# EAGLE schematic ARCS_MEGA_schematic (EAGLE 9.7.0)
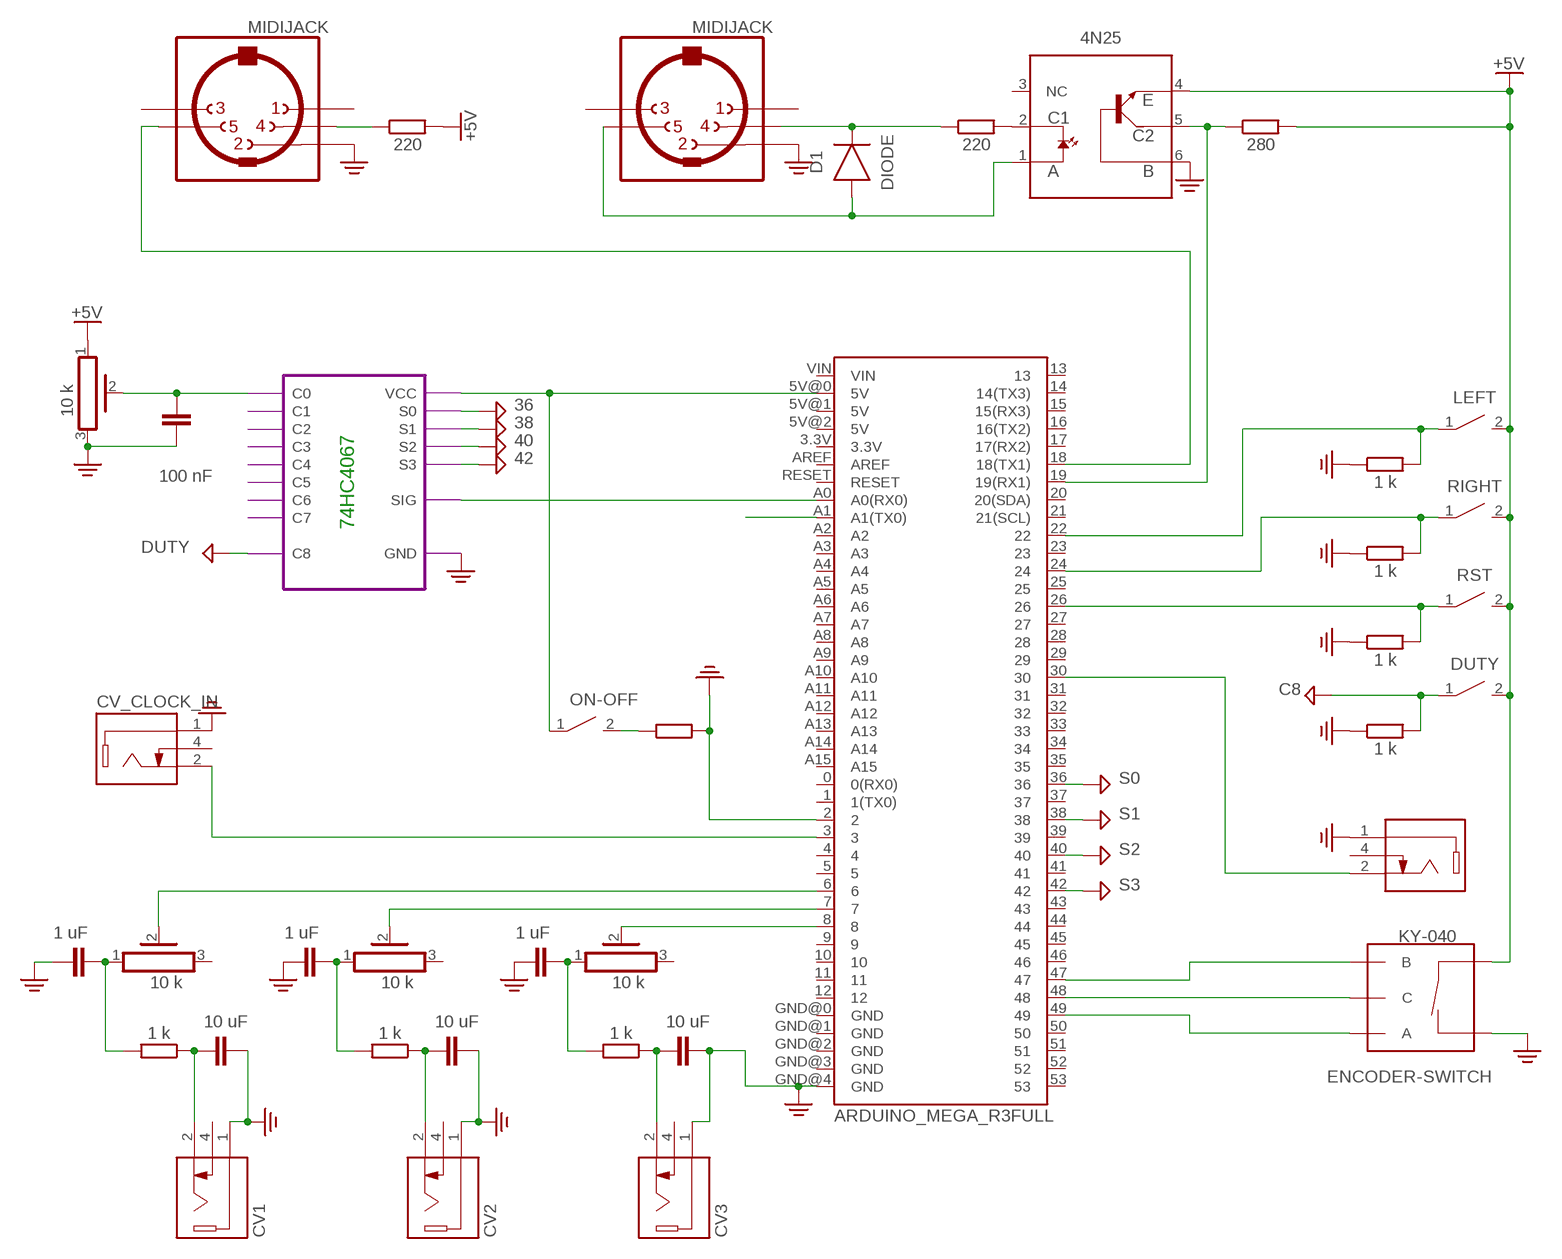
[diagram p0: schematic, sheet 1]

## Parts
B1  ARDUINO_MEGA_R3FULL  [ARDUINO_MEGA]
C1  100 nF  C_RADIAL-55.5MM-DIA  [CAPRD2261W240D5080H5555B]
C2  1 uF  C_RADIAL-55.5MM-DIA  [CAPRD2261W240D5080H5555B]
C3  10 uF  C_RADIAL-55.5MM-DIA  [CAPRD2261W240D5080H5555B]
C4  1 uF  C_RADIAL-55.5MM-DIA  [CAPRD2261W240D5080H5555B]
C5  10 uF  C_RADIAL-55.5MM-DIA  [CAPRD2261W240D5080H5555B]
C6  1 uF  C_RADIAL-55.5MM-DIA  [CAPRD2261W240D5080H5555B]
C7  10 uF  C_RADIAL-55.5MM-DIA  [CAPRD2261W240D5080H5555B]
CV1  MJ-2523-SMT-TR  [MJ-2523-SMT-TR]
CV2  MJ-2523-SMT-TR  [MJ-2523-SMT-TR]
CV3  MJ-2523-SMT-TR  [MJ-2523-SMT-TR]
CV_CLOCK_IN  MJ-2523-SMT-TR  [MJ-2523-SMT-TR]
D1  DIODE  DIODEDO-214AB(SMC)  [DIOM7959X625N]
DUTY  B3U-3000P(M)-B  B3U-X000B3U3000P(M)-B3000P(M)-B  [B3U-3000P(M)-B]
GATE_OUT  MJ-2523-SMT-TR  [MJ-2523-SMT-TR]
IC1  4N25  [DIP762W60P254L712H480Q6B]
KY-040  ENCODER-SWITCH  [ROTARY_ENC_PLAIN]
LEFT  B3U-3000P(M)-B  B3U-X000B3U3000P(M)-B3000P(M)-B  [B3U-3000P(M)-B]
ON-OFF  B3U-3000P(M)-B  B3U-X000B3U3000P(M)-B3000P(M)-B  [B3U-3000P(M)-B]
R1  1 k  R_AXIAL-7.2MM-PITCH  [RESAD724W46L381D178B]
R2  1 k  R_AXIAL-7.2MM-PITCH  [RESAD724W46L381D178B]
R3  1 k  R_AXIAL-7.2MM-PITCH  [RESAD724W46L381D178B]
R4  1 k  R_AXIAL-7.2MM-PITCH  [RESAD724W46L381D178B]
R5  1 k  R_AXIAL-7.2MM-PITCH  [RESAD724W46L381D178B]
R6  10 k  PV36Z  [PV36Z]
R7  10 k  PV36Z  [PV36Z]
R8  10 k  PV36Z  [PV36Z]
R9  1 k  R_AXIAL-7.2MM-PITCH  [RESAD724W46L381D178B]
R10  1 k  R_AXIAL-7.2MM-PITCH  [RESAD724W46L381D178B]
R11  10 k  PV36Z  [PV36Z]
R12  1 k  R_AXIAL-7.2MM-PITCH  [RESAD724W46L381D178B]
R13  280  R_AXIAL-7.2MM-PITCH  [RESAD724W46L381D178B]
R14  220  R_AXIAL-7.2MM-PITCH  [RESAD724W46L381D178B]
R15  220  R_AXIAL-7.2MM-PITCH  [RESAD724W46L381D178B]
RIGHT  B3U-3000P(M)-B  B3U-X000B3U3000P(M)-B3000P(M)-B  [B3U-3000P(M)-B]
RST  B3U-3000P(M)-B  B3U-X000B3U3000P(M)-B3000P(M)-B  [B3U-3000P(M)-B]
U$1  MIDIJACK  [CP-2350]
U$2  MIDIJACK  [CP-2350]

## Module instances
74HC4067 = 74HC4067

## Nets
36: port 74HC4067.S0 ; supply symbol labelled GND
38: port 74HC4067.S1 ; supply symbol labelled GND
40: port 74HC4067.S2 ; supply symbol labelled GND
42: port 74HC4067.S3 ; supply symbol labelled GND
+5V: DUTY.2 IC1.4(E) KY-040.SW+ LEFT.2 R6.1 R13.2 R15.2 RIGHT.2 RST.2
C8: DUTY.1 R4.2 ; supply symbol labelled GND
EGND: IC1.6(B) U$1.2
GND: B1.2 B1.GND@4(GND) C1.2 C2.1 C3.2 C4.1 C5.2 C6.1 C7.2 CV1.1(SLEEVE) CV2.1(SLEEVE) CV3.1(SLEEVE) CV_CLOCK_IN.1(SLEEVE) GATE_OUT.1(SLEEVE) KY-040.SW- R1.1 R2.1 R3.1 R4.1 R5.2 R6.3 U$2.2 ; port 74HC4067.GND
N$1: B1.26 R3.2 RST.1
N$2: B1.22 LEFT.1 R1.2
N$3: B1.24 R2.2 RIGHT.1
N$4: B1.A0(A0(RX0)) ; port 74HC4067.SIG
N$5: ON-OFF.2 R5.1
N$6: B1.30 GATE_OUT.2(TIP)
N$7: B1.5V@0(5V) ON-OFF.1 ; port 74HC4067.VCC
N$8: C2.2 R8.1 R9.2
N$9: C3.1 CV1.2(TIP) R9.1
N$10: R15.1 U$2.4
N$11: B1.18(18(TX1)) U$2.5
N$12: B1.49 KY-040.A
N$13: B1.47 KY-040.B
N$14: B1.48 KY-040.C
N$15: C5.1 CV2.2(TIP) R10.1
N$16: C4.2 R7.1 R10.2
N$17: C1.1 R6.2 ; port 74HC4067.C0
N$18: B1.6 R8.2
N$19: B1.3 CV_CLOCK_IN.2(TIP)
N$20: C7.1 CV3.2(TIP) R12.1
N$21: C6.2 R11.1 R12.2
N$22: B1.7 R7.2
N$23: B1.8 R11.2
N$24: D1.1(C) R14.1 U$1.4
N$25: IC1.2(C1) R14.2
N$26: D1.2(A) IC1.1(A) U$1.5
N$27: B1.19(19(RX1)) IC1.5(C2) R13.1
N$28: B1.A1(A1(TX0))
S0: B1.36 ; supply symbol labelled GND
S1: B1.38 ; supply symbol labelled GND
S2: B1.40 ; supply symbol labelled GND
S3: B1.42 ; supply symbol labelled GND
Unconnected: B1.0(0(RX0)) B1.1(1(TX0)) B1.3.3V B1.4 B1.5 B1.5V@1(5V) B1.5V@2(5V) B1.9 B1.10 B1.11 B1.12 B1.13 B1.14(14(TX3)) B1.15(15(RX3)) B1.16(16(TX2)) B1.17(17(RX2)) B1.20(20(SDA)) B1.21(21(SCL)) B1.23 B1.25 B1.27 B1.28 B1.29 B1.31 B1.32 B1.33 B1.34 B1.35 B1.37 B1.39 B1.41 B1.43 B1.44 B1.45 B1.46 B1.50 B1.51 B1.52 B1.53 B1.A2 B1.A3 B1.A4 B1.A5 B1.A6 B1.A7 B1.A8 B1.A9 B1.A10 B1.A11 B1.A12 B1.A13 B1.A14 B1.A15 B1.AREF B1.GND@0(GND) B1.GND@1(GND) B1.GND@2(GND) B1.GND@3(GND) B1.RESET B1.VIN CV1.4(TIP_SWITCH) CV2.4(TIP_SWITCH) CV3.4(TIP_SWITCH) CV_CLOCK_IN.4(TIP_SWITCH) GATE_OUT.4(TIP_SWITCH) IC1.3(NC) R7.3 R8.3 R11.3 U$1.1 U$1.3 U$1.PE1(MT) U$1.PE2(MT) U$1.PE(MT) U$1.PE@(MT) U$2.1 U$2.3 U$2.PE1(MT) U$2.PE2(MT) U$2.PE(MT) U$2.PE@(MT)

## Library data of the parts
B1 = SparkFun-Boards:ARDUINO_MEGA_R3: Arduino Mega R3 ATmega2560 R3 compatible footprint. SparkFun Products: Arduino Mega 2560 R3 <https://www.sparkfun.com/products/11061>
C1 = Capacitor:C: Capacitor - Generic; CATEGORY: Capacitor
C2-C7 = Tutorial - Fusion 360:C: Capacitor - Generic; CATEGORY: Capacitor
CV1-CV3 CV_CLOCK_IN GATE_OUT = Audio Connectors:MJ-2523-SMT-TR: CONN JACK MONO 2.5MM SMD R/A Manufacturer's datasheet <https://www.cuidevices.com/product/resource/mj-2523-smt-tr.pdf>; CREATED_BY: PCBLayout.com; DIGIKEY_PN: CP-2523MJTR-ND; MANUFACTURER: CUI Devices; MPN: MJ-2523-SMT-TR
D1 = Diode:DIODE: Diode Rectifier - Generic; CATEGORY: Diode; SUB-CATEGORY: Rectifier
DUTY LEFT ON-OFF RIGHT RST = Switch:B3U-X000: Ultra-small Tactile Switch Contact form : SPST-NO Datasheet <https://omronfs.omron.com/en_US/ecb/products/pdf/en-b3u.pdf>; CATEGORY: SWITCH; DESCRIPTION: Ultra-small Surface-mounting Tactile Switches with High Contact Reliability; MANUFACTURER: OMRON; OPERATING_TEMPERATURE: -25°C to +70°C; PART_STATUS: ACTIVE; ROHS_COMPLIANCE: RoHS Compliant; SERIES: B3U; TYPE: Tactile
IC1 = Opto-Electronic:4N: Optocoupler, Phototransistor Output, with Base Connection Datasheet <https://www.vishay.com/docs/83725/4n25.pdf>; CATEGORY: Opto-Electronic; DESCRIPTION: Optoisolator Transistor with Base Output 5000Vrms Channel 6-DIP; MANUFACTURER: Vishay; MPN: 4N25; OPERATING_TEMP: - 55°C to + 100 °C; PART_STATUS: Active; ROHS_COMPLIANT: COMPLIANT; SERIES: 4N2x; SUB-CATEGORY: Optocoupler; THERMALLOSS: 0.150 W
KY-040 = SparkFun-Switches:ENCODER-SWITCH: Rotary Encoder w/ Select Switch Encoders rotate similarly to potentiometers, but they’re different from potentiometers in that an encoder has full rotation without limits. They output gray code so that you can tell how much and in which direction the encoder has been turned. This encoder includes a push-down select switch built into the shaft. SparkFun Products Rotary Encoder <https://www.sparkfun.com/products/9117> (COM-09117); SF_SKU: COM-09117
R1-R5 R9 R10 R12-R15 = Resistor:R: Resistor Fixed - Generic; CATEGORY: Resistor; SUB-CATEGORY: Fixed
R6-R8 R11 = Resistor:PV36: Rectangular Trimmer Potentiometers - PV36 Series Datasheet <https://www.bourns.com/docs/Product-Datasheets/pv36.pdf>; CATEGORY: Resistor; DESCRIPTION: Lead Sealed Type Multiturn PV36 Series; MANUFACTURER: BOURNS; MPN: PV36Z; OPERATING_TEMPERATURE: -55 to +125 °C; PART_STATUS: Active; ROHS_COMPLIANCE: RoHS Compliant; SERIES: PV36; SUB-CATEGORY: Trimpot; TYPE: Lead Sealed
U$1 U$2 = adafruit:MIDIJACK: DIN 5 jack also known as MIDI jack A modification of conn-hirshman:MAB5SH with two options for the grounding 'teeth'

## Module MIDI_DIN
Ports: 

### Library data of the parts

## Module 74HC4067
Ports: C0(in) C1(in) C2(in) C3(in) C4(in) C5(in) C6(in) C7(in) VCC(in) GND(pwr) S0(oc) S1(oc) S2(oc) S3(oc) SIG(oc) C8(pas)

### Library data of the parts